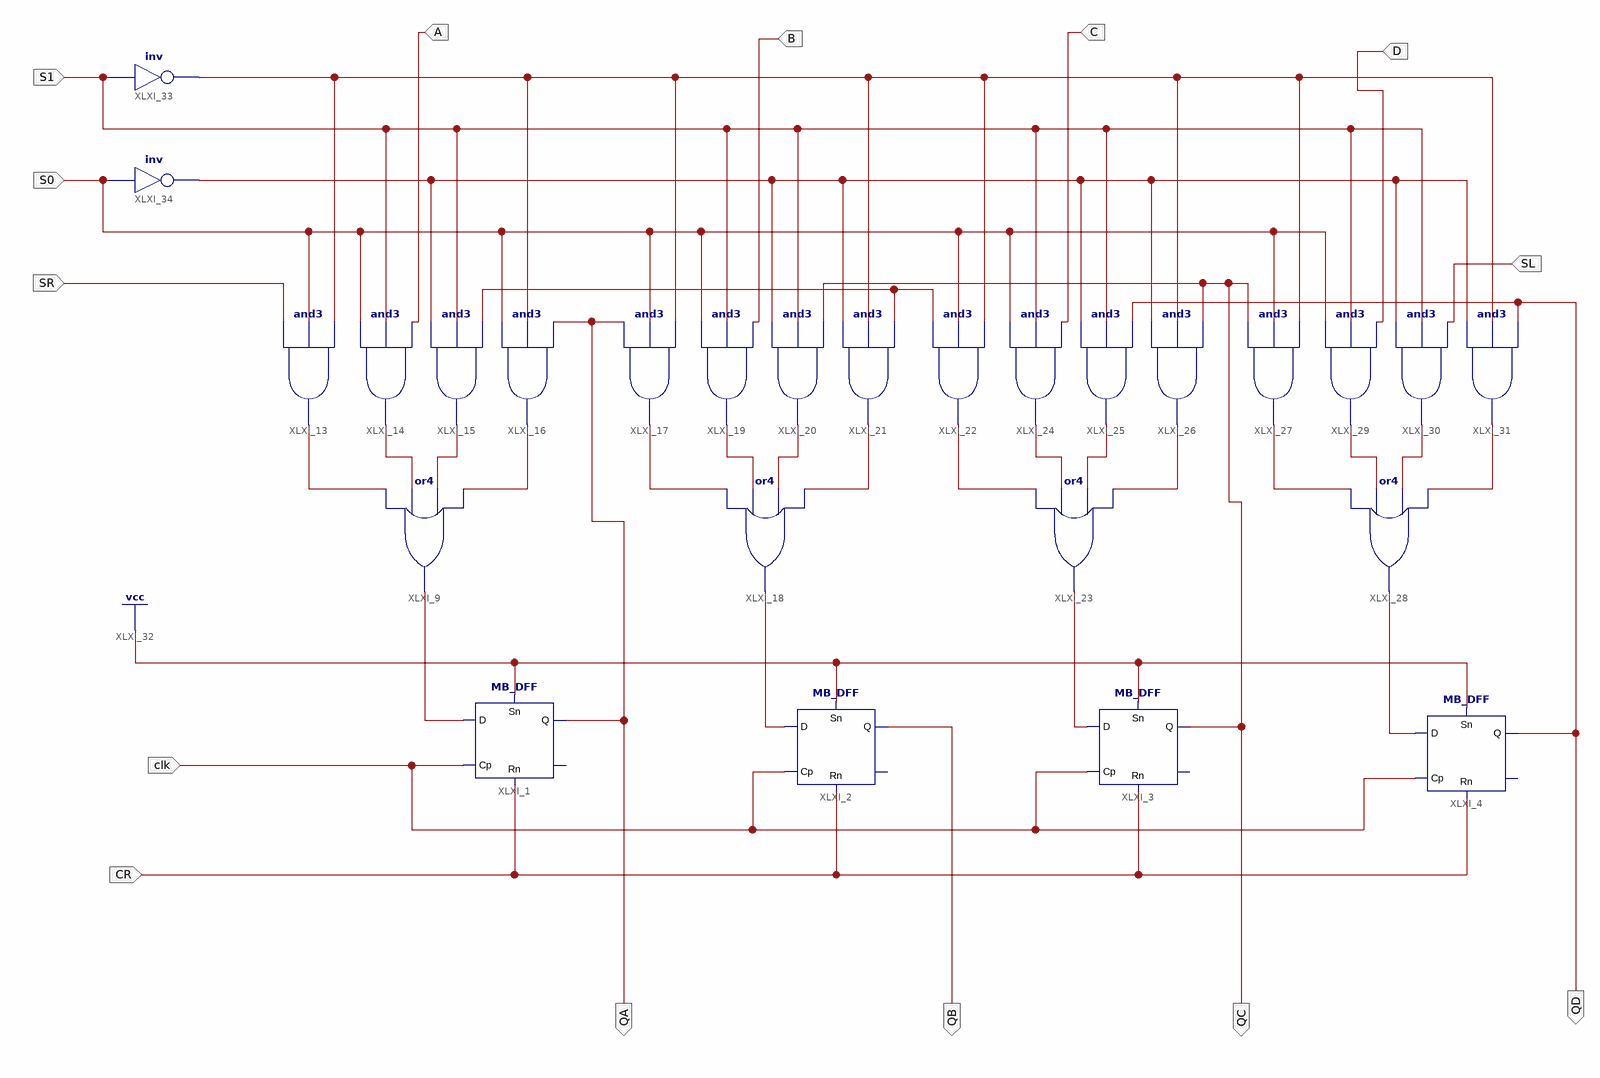
[diagram p0: schematic sheet 1]
// Xilinx ISE schematic DM74LS194.sch (kintex7) as structural Verilog: 26 symbols, 14 ports
module DM74LS194 (
  input  clk,
  input  CR,
  input  S1,
  input  S0,
  input  SR,
  input  A,
  input  B,
  input  C,
  input  D,
  input  SL,
  output QA,
  output QB,
  output QC,
  output QD
);

  wire XLXN_1, XLXN_2, XLXN_3, XLXN_4, XLXN_5, XLXN_6, XLXN_7, XLXN_8, XLXN_9, XLXN_10, XLXN_11, XLXN_12,
       XLXN_13, XLXN_14, XLXN_15, XLXN_16, XLXN_17, XLXN_18, XLXN_19, XLXN_20, XLXN_45, XLXN_46, XLXN_48;

  MB_DFF XLXI_1 (.D(XLXN_17), .Cp(clk), .Sn(1'b1), .Rn(CR), .Q(QA));  // open: Qn
  MB_DFF XLXI_2 (.D(XLXN_19), .Cp(clk), .Sn(1'b1), .Rn(CR), .Q(QB));  // open: Qn
  MB_DFF XLXI_3 (.D(XLXN_18), .Cp(clk), .Sn(1'b1), .Rn(CR), .Q(QC));  // open: Qn
  MB_DFF XLXI_4 (.D(XLXN_20), .Cp(clk), .Sn(1'b1), .Rn(CR), .Q(QD));  // open: Qn
  or XLXI_9 (XLXN_17, XLXN_1, XLXN_2, XLXN_3, XLXN_4);
  and XLXI_13 (XLXN_1, SR, S0, XLXN_45);
  and XLXI_14 (XLXN_2, S0, S1, A);
  and XLXI_15 (XLXN_3, XLXN_46, S1, XLXN_48);
  and XLXI_16 (XLXN_4, S0, XLXN_45, QA);
  and XLXI_17 (XLXN_5, QA, S0, XLXN_45);
  or XLXI_18 (XLXN_19, XLXN_5, XLXN_6, XLXN_7, XLXN_8);
  and XLXI_19 (XLXN_6, S0, S1, B);
  and XLXI_20 (XLXN_7, XLXN_46, S1, QC);
  and XLXI_21 (XLXN_8, XLXN_46, XLXN_45, XLXN_48);
  and XLXI_22 (XLXN_9, XLXN_48, S0, XLXN_45);
  or XLXI_23 (XLXN_18, XLXN_9, XLXN_10, XLXN_11, XLXN_12);
  and XLXI_24 (XLXN_10, S0, S1, C);
  and XLXI_25 (XLXN_11, XLXN_46, S1, QD);
  and XLXI_26 (XLXN_12, XLXN_46, XLXN_45, QC);
  and XLXI_27 (XLXN_13, QC, S0, XLXN_45);
  or XLXI_28 (XLXN_20, XLXN_13, XLXN_14, XLXN_15, XLXN_16);
  and XLXI_29 (XLXN_14, S0, S1, D);
  and XLXI_30 (XLXN_15, XLXN_46, S1, SL);
  and XLXI_31 (XLXN_16, XLXN_46, XLXN_45, QD);
  not XLXI_33 (XLXN_45, S1);
  not XLXI_34 (XLXN_46, S0);
endmodule
